# Altium schematic sheet USB Sheet (ATmega8U2-MU).SchDoc
size A4
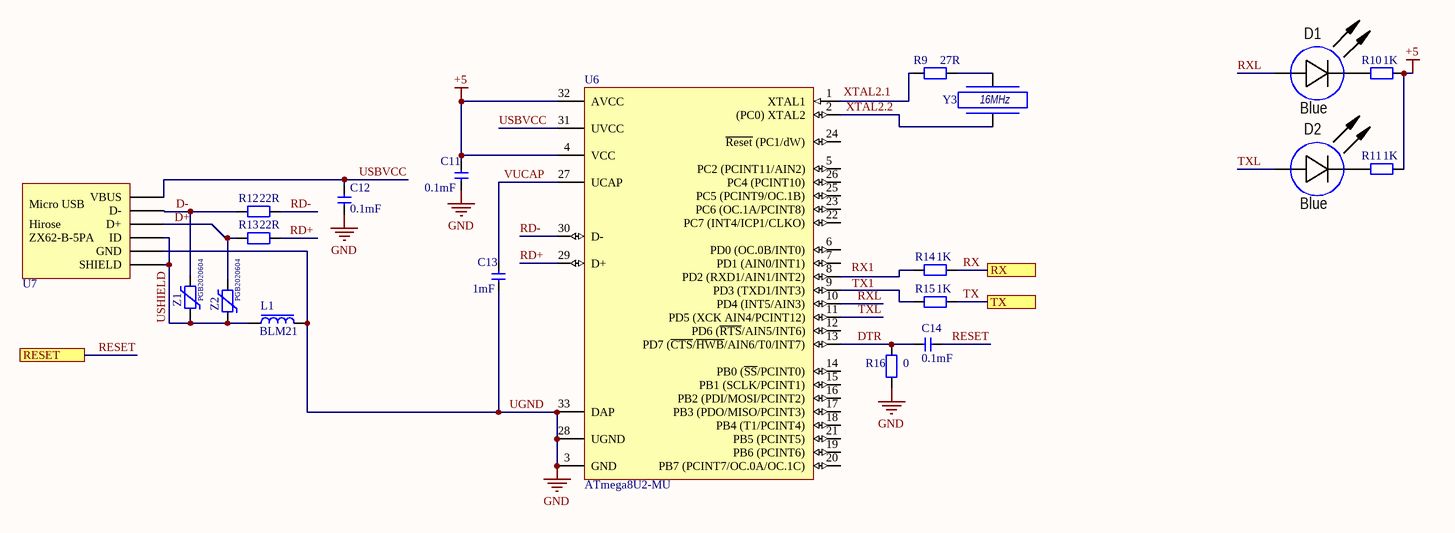
[diagram p0: USB Sheet (ATmega8U2-MU).SchDoc]

## Parts
C11  0.1mF  [cap0603]
C12  0.1mF  [cap0603]
C13  1mF  [cap0603]
C14  0.1mF  [cap0603]
D1  Blue  [CH0805LB]
D2  Blue  [CH0805LB]
L1  BLM21  [res0805]
R9  27R  [res0603]
R10  1K  [res0603]
R11  1K  [res0603]
R12  22R  [res0603]
R13  22R  [res0603]
R14  1K  [res0603]
R15  1K  [res0603]
R16  0  [res0603]
U6  ATmega8U2-MU  [32PG_N]
U7  ZX62-B-5PA  [ZX62-B-5PA]  (value not drawn)
Y3  16MHz  [QSMD5.0x3.2x1.0]
Z1  PGB2020604  [res0603]
Z2  PGB2020604  [res0603]

## Ports
RESET, RX, TX

## Nets
+5: C11.2 R10.2 R11.2 U6.4(VCC) U6.32(AVCC)
UGND: C11.1 C12.1 C13.1 L1.2 R16.1 U6.3(GND) U6.28(UGND) U6.33(DAP) U7.5(GND)  [also labelled GND]
D-: R12.1 U7.2(D-) Z1.2
DTR: C14.1 R16.2 U6.13(PD7_(~{CTS}/~{HWB}/AIN6/T0/INT7))
RD+: R13.2 U6.29(D+)
RD-: R12.2 U6.30(D-)
RESET: C14.2 ; port RESET
RX: R14.2 ; port RX
RXL: D1.1(A) U6.10(PD4_(INT5/AIN3))
TX: R15.2 ; port TX
TXL: D2.1(A) U6.11(PD5_(XCK_AIN4/PCINT12))
USBVCC: C12.2 U6.31(UVCC) U7.1(VBUS)
USHIELD: L1.1 U7.4(ID) U7.6(SHIELD) Z1.1 Z2.1
VUCAP: C13.2 U6.27(UCAP)
XTAL2.2: U6.2((PC0)_XTAL2) Y3.1
NetD1_2: D1.2(C) R10.1
NetD2_2: D2.2(C) R11.1
NetR9_1: R9.1 U6.1(XTAL1)
NetR9_2: R9.2 Y3.2
NetR13_1: R13.1 U7.3(D+) Z2.2
NetR14_1: R14.1 U6.8(PD2_(RXD1/AIN1/INT2))
NetR15_1: R15.1 U6.9(PD3_(TXD1/INT3))

Not connected (* = marked no-connect by the designer): U6 5(PC2_(PCINT11/AIN2)) 6(PD0_(OC.0B/INT0)) 7(PD1_(AIN0/INT1)) 12(PD6_(~{RTS}/AIN5/INT6)) 14(PB0_(~{SS}/PCINT0)) 15(PB1_(SCLK/PCINT1)) 16(PB2_(PDI/MOSI/PCINT2)) 17(PB3_(PDO/MISO/PCINT3)) 18(PB4_(T1/PCINT4)) 19(PB6_(PCINT6)) 20(PB7_(PCINT7/OC.0A/OC.1C)) 21(PB5_(PCINT5)) 22(PC7_(INT4/ICP1/CLKO)) 23(PC6_(OC.1A/PCINT8)) 24(~{Reset}_(PC1/dW)) 25(PC5_(PCINT9/OC.1B)) 26(PC4_(PCINT10))

## Notes on the sheet
- Labels drawn without touching a wire or pin: D+, RX1, TX1, XTAL2.1
- (in symbol ZX62-B-5PA) Micro USB; Hirose

## Library data of the parts
C11-C14 = Cap SMD
D1 D2 = LED: Manufacturer: *; Model: *; HelpURL: *; ComponentKind: *; Value: *
L1 = Drossel
R9-R16 = Resistor SMD
U6 = ATmega8U2-MU: 8-bit AVR Microcontroller, 2.7-5.5V, 8KB Flash, 512 Bytes EEPROM, 512 Bytes SRAM, 32-pin VQFN, Industrial Grade (-40°C to 85°C); Published: 1-Apr-2010; DatasheetVersion: revC, Dec-2009; PackageVersion: revA, Oct-2008; PackageReference: 32PG; Publisher: Altium Limited; PackageDescription: 32-Pin Quad Flat No-Lead (QFN) Sawn,  5 x 5 x 1.0 mm Body, Pitch 0.50 mm, 3.60mm Exposed Pad; Supplier 1: Digi-Key; Supplier Part Number 1: ATMEGA8U2-MU-ND; Supplier 2: Farnell; Supplier Part Number 2: 1748536; Supplier 3: Mouser; Supplier Part Number 3: 556-ATMEGA8U2-MU; Code_JEDEC: MO-220WHHD-2; ComponentLink1Description: Manufacturer Link; ComponentLink1URL: http://www.atmel.com/products/avr/default.asp?; ComponentLink2Description: ATmega8U2/16U2/32U2 Datasheet; ComponentLink2URL: http://www.atmel.com/dyn/resources/prod_documents/doc7799.pdf; ComponentLink3Description: ATmega8U2/16U2/32U2 Summary; ComponentLink3URL: http://www.atmel.com/dyn/resources/prod_documents/7799S.pdf; ComponentLink4Description: Atmel.com Home; ComponentLink4URL: http://www.atmel.com
Y3 = Crystal: Кварцевый резонатор; Value: 16MHz
Z1 Z2 = Varistor